# EAGLE schematic SkeinTwister (EAGLE 9.6.2)
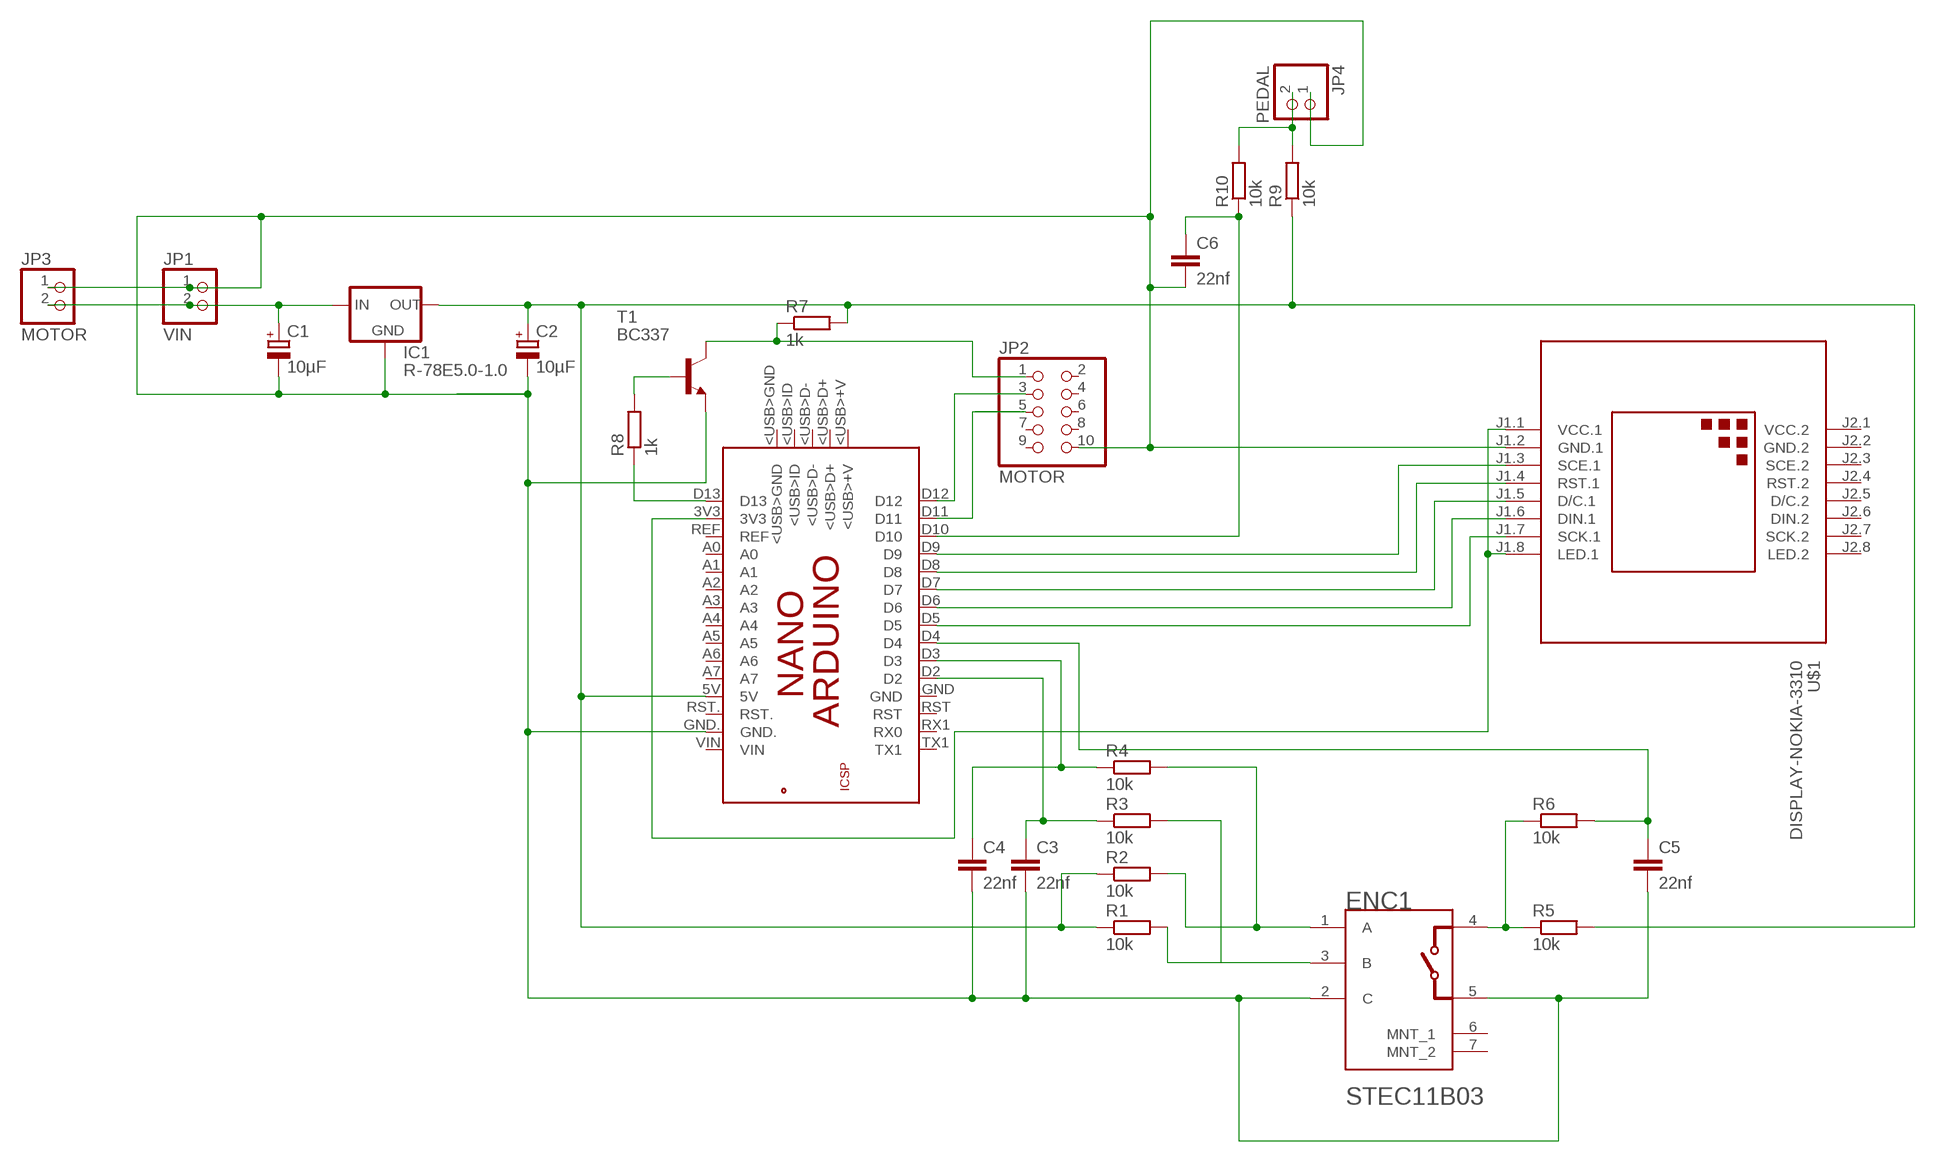
[diagram p0: schematic, sheet 1]

## Parts
C1  10µF  CPOL-EUE5-5  [E5-5]
C2  10µF  CPOL-EUE5-5  [E5-5]
C3  22nf  C-EU025-024X044  [C025-024X044]
C4  22nf  C-EU025-024X044  [C025-024X044]
C5  22nf  C-EU025-024X044  [C025-024X044]
C6  22nf  C-EU025-024X044  [C025-024X044]
ENC1  ALPS_STEC11B03ALPS_STEC11B03_0_0  [ALPS_STEC11B03_0]
IC1  R-78E5.0-1.0  [SIP3]
JP1  VIN  PINHD-1X2  [1X02]
JP2  MOTOR  PINHD-2X5  [2X05]
JP3  MOTOR  PINHD-1X2  [1X02]
JP4  PEDAL  PINHD-1X2  [1X02]
PCB2  ARDUINO_NANO  [ARDUINO_NANO]
R1  10k  R-EU_0204/5  [0204/5]
R2  10k  R-EU_0204/5  [0204/5]
R3  10k  R-EU_0204/5  [0204/5]
R4  10k  R-EU_0204/5  [0204/5]
R5  10k  R-EU_0204/5  [0204/5]
R6  10k  R-EU_0204/5  [0204/5]
R7  1k  R-EU_0204/5  [0204/5]
R8  1k  R-EU_0204/5  [0204/5]
R9  10k  R-EU_0204/5  [0204/5]
R10  10k  R-EU_0204/5  [0204/5]
T1  BC337  [TO92]
U$1  DISPLAY-NOKIA-3310  [DISPLAY-NOKIA-3310]

## Nets
N$1: C1.+ IC1.1(IN) JP1.2 JP3.2
N$2: PCB2.D5 U$1.J1.7(SCK.1)
N$3: C2.+ IC1.3(OUT) PCB2.5V R1.1 R2.1 R5.2 R7.2 R9.1
N$4: ENC1.3(B) R1.2 R3.2
N$5: ENC1.1(A) R2.2 R4.2
N$6: C5.1 PCB2.D4 R6.2
N$7: C3.1 PCB2.D2 R3.1
N$8: C4.1 PCB2.D3 R4.1
N$9: ENC1.4 R5.1 R6.1
N$10: JP2.3 PCB2.D12
N$11: JP2.5 PCB2.D11
N$12: PCB2.D13 R8.1
N$13: R8.2 T1.2(B)
N$14: JP2.1 R7.1 T1.3(C)
N$15: C1.- C2.- C3.2 C4.2 C5.2 C6.2 ENC1.2(C) ENC1.5 IC1.2(GND) JP1.1 JP2.10 JP3.1 JP4.1 PCB2.GND. T1.1(E) U$1.J1.2(GND.1)
N$16: PCB2.D6 U$1.J1.6(DIN.1)
N$17: PCB2.D7 U$1.J1.5(D/C.1)
N$18: PCB2.D8 U$1.J1.4(RST.1)
N$19: PCB2.D9 U$1.J1.3(SCE.1)
N$20: JP4.2 R9.2 R10.2
N$21: C6.1 PCB2.D10 R10.1
N$22: PCB2.3V3 U$1.J1.1(VCC.1) U$1.J1.8(LED.1)
Unconnected: ENC1.6(MNT_1) ENC1.7(MNT_2) JP2.2 JP2.4 JP2.6 JP2.7 JP2.8 JP2.9 PCB2.5V. PCB2.<USB>+V PCB2.<USB>D+ PCB2.<USB>D- PCB2.<USB>GND PCB2.<USB>ID PCB2.A0 PCB2.A1 PCB2.A2 PCB2.A3 PCB2.A4 PCB2.A5 PCB2.A6 PCB2.A7 PCB2.GND PCB2.GND_ PCB2.MISO PCB2.MOSI PCB2.REF PCB2.RESET.. PCB2.RST PCB2.RST. PCB2.RX1(RX0) PCB2.SCK PCB2.TX1 PCB2.VIN U$1.J2.3(SCE.2) U$1.J2.4(RST.2) U$1.J2.5(D/C.2) U$1.J2.6(DIN.2) U$1.J2.7(SCK.2) U$1.J2.8(LED.2)

## Power pins joined to a net without a drawn wire
GND.2: U$1.J2.2(GND.2)
VCC.2: U$1.J2.1(VCC.2)

## Library data of the parts
C1 C2 = rcl:CPOL-EU: POLARIZED CAPACITOR, European symbol; SPICEPREFIX: C
C3-C6 = rcl:C-EU: CAPACITOR, European symbol; SPICEPREFIX: C
ENC1 = ALPS - STEC11B03:ALPS_STEC11B03: Encoder 11mm Vert. 15imp/30pos Metal Shaft 6/25 Slot Switch; AUTOMOTIVE: No; CENTROID_NOT_SPECIFIED: No; CONN_ORIENTATION: Vertical; CURRENT_RATING: 10mA; DATASHEET: https://datasheet.ciiva.com/29120/700697-da-01-en-encoder-stec11b03-29120978.pdf; DETENT: Yes; DEVICE_CLASS_L1: Electromechanical; DEVICE_CLASS_L2: Switches; DEVICE_CLASS_L3: Encoders; ENCODER_TYPE: Incremental; FOOTPRINT_VARIANT_NAME_0: Recommended_Land_Pattern; HEIGHT: 32.1mm; LEAD_FREE: Yes; MF: ALPS; MFG_PACKAGE_IDENT: STEC11B03; MFG_PACKAGE_IDENT_DATE: 0; MFG_PACKAGE_IDENT_REV: 0; MPN: STEC11B03; PACKAGE: PTH_ENC_11MM70_13MM75; PREFIX: ENC; PULSES_PER_REV: 15; ROHS: Yes; TEMPERATURE_RANGE_HIGH: +70°C; TEMPERATURE_RANGE_LOW: -30°C; VERIFICATION_VERSION: 0.0.0.1; VOLTAGE_RATING_DC: 5V
IC1 = r-78xx_10:R-78E*-1.0: Innoline R-78xx-1.0 Series Switching Regulators - 1.0A, Low Cost Source: http://www.recom-international.com/pdf/Innoline/R-78Exx-1.0.pdf; MF: Recom; MPN: R-785.0-1.0; OC_FARNELL: unknown; OC_NEWARK: 83X9336
JP1 JP3 JP4 = pinhead:PINHD-1X2: PIN HEADER
JP2 = pinhead:PINHD-2X5: PIN HEADER
PCB2 = E14_Arduino_revC:ARDUINO_NANO: Device for representing an Arduino Nano board with a footprint in an EAGLE design. Created by Dave Young for Element14. More EAGLE documentation at: http://www.element14.com/community/community/knode/cadsoft_eagle
R1-R10 = rcl:R-EU_: RESISTOR, European symbol; SPICEPREFIX: R
T1 = transistor:BC337: NPN TRANSISTOR
U$1 = diy-modules:DISPLAY-NOKIA-3310: 84x48 Dot Matrix LCD Module based on Nokia 3310 display More details available here: https://arduinoandsoftware.wordpress.com/2012/12/30/nokia-33105110-3-3v-display-with-5v-arduino/